# EAGLE design ekta_mcp1640_eval_002 (EAGLE 5.10)
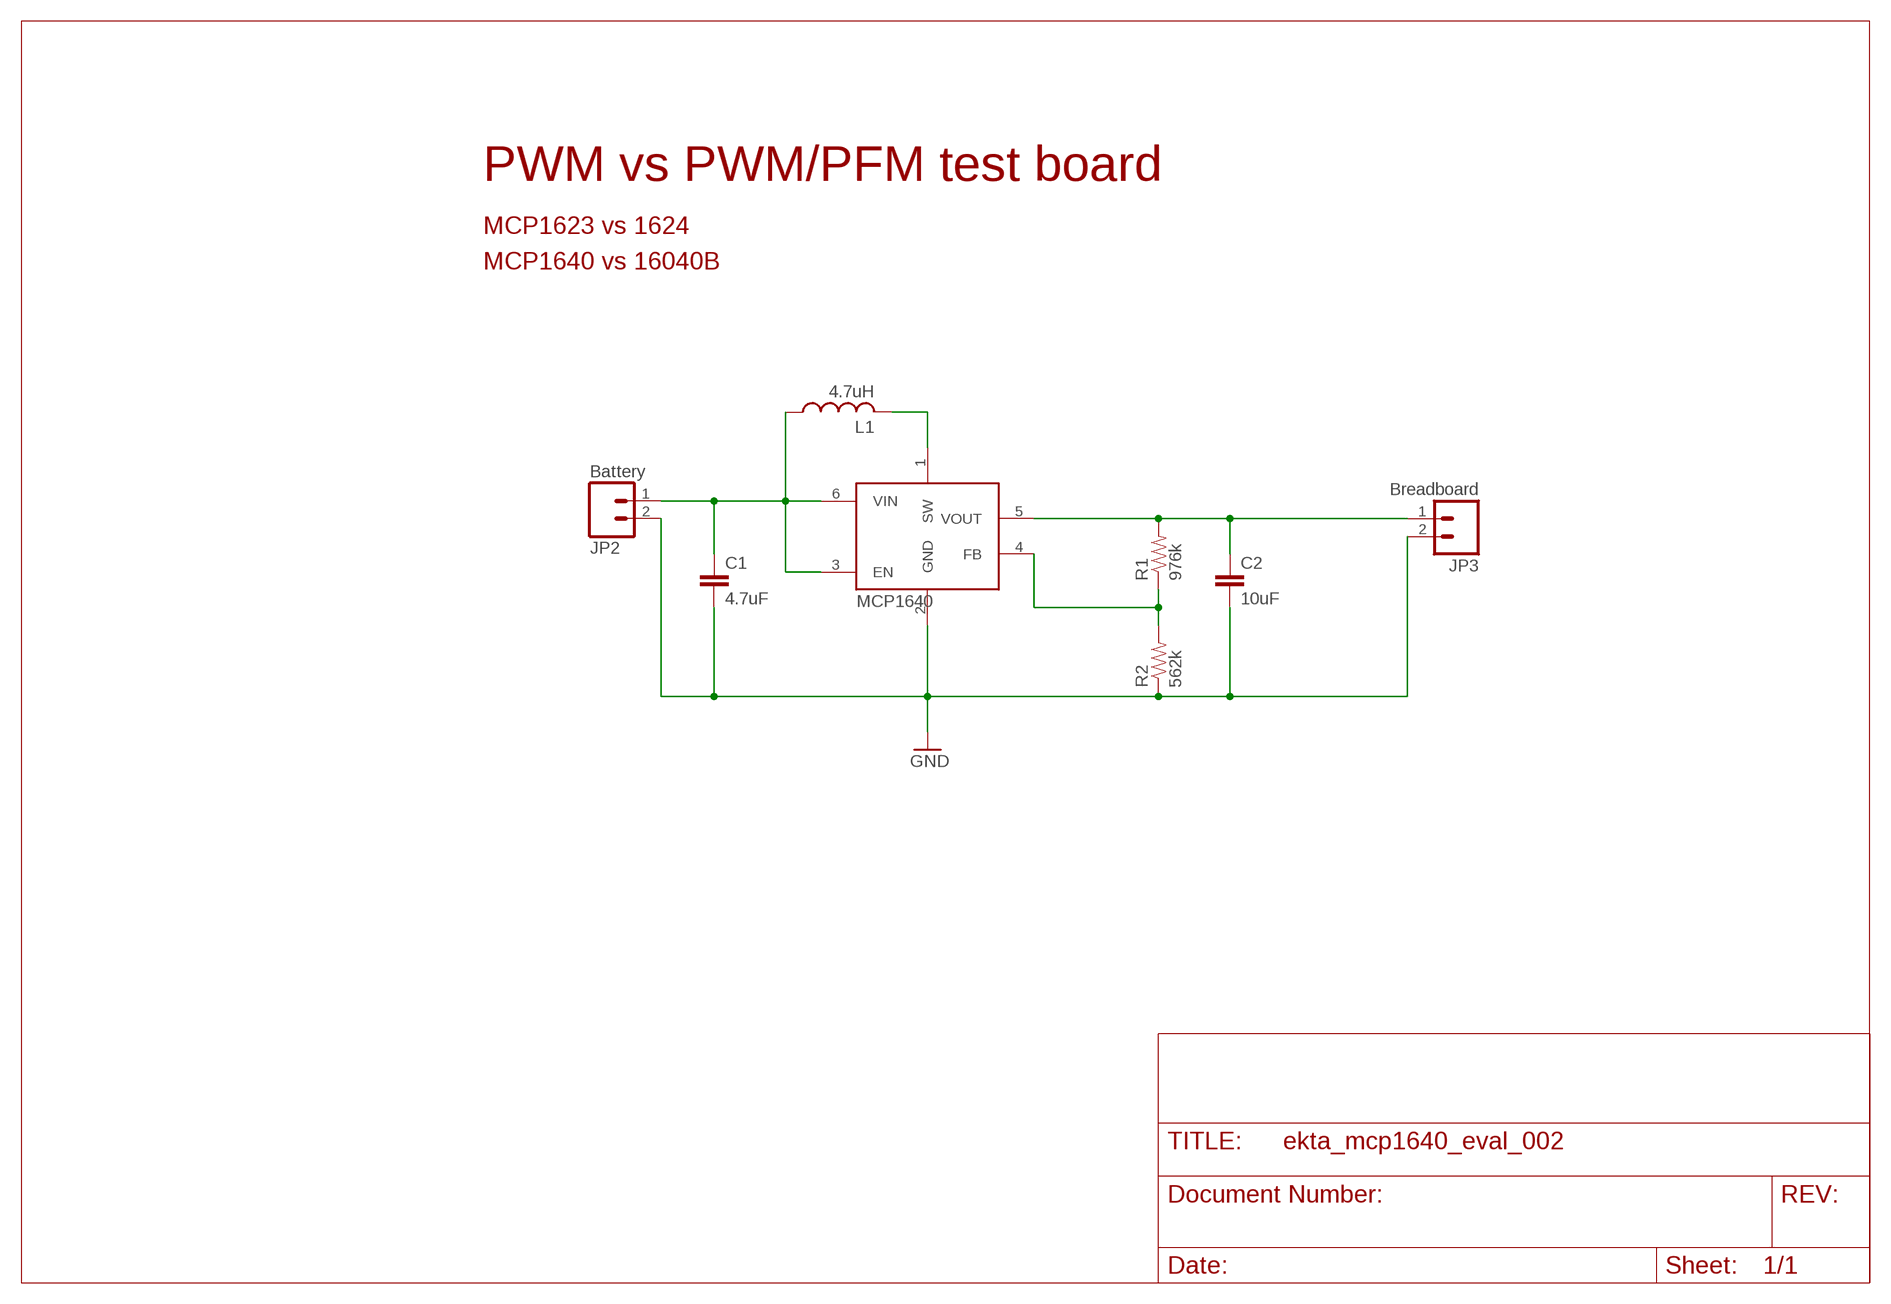
[diagram p0: schematic, sheet 1]

## Parts
C1  4.7uF  CAP0805  [0805]
C2  10uF  CAP0805  [0805]
JP2  Battery  M02PTH  [1X02]
JP3  Breadboard  M02PTH  [1X02]
L1  4.7uH  LLQH44P_P0  [LQH44]
R1  976k  RESISTOR0805-RES  [0805]
R2  562k  RESISTOR0805-RES  [0805]
U1  MCP1640  [SOT23-6]

## Nets
BAT+: C1.1 JP2.1 L1.P$1 U1.3(EN) U1.6(VIN)
GND: C1.2 C2.2 JP2.2 JP3.2 R2.1 U1.2(GND)
N$1: L1.P$2 U1.1(SW)
N$2: C2.1 JP3.1 R1.2 U1.5(VOUT)
N$4: R1.1 R2.2 U1.4(FB)

## Notes on the sheet
- PWM vs PWM/PFM test board
- MCP1623 vs 1624
- MCP1640 vs 16040B

## Library data of the parts
C1 C2 = SparkFun:CAP: Capacitor Standard 0603 ceramic capacitor, and 0.1" leaded capacitor.
JP2 JP3 = SparkFun:M02: Header 2 Standard 2-pin 0.1" header. Use with straight break away headers (SKU : PRT-00116), right angle break away headers (PRT-00553), swiss pins (PRT-00743), machine pins (PRT-00117), and female headers (PRT-00115). Molex polarized connector foot print use with SKU : PRT-08233 with associated crimp pins and housings.
L1 = karlnet-parts:L
R1 R2 = SparkFun:RESISTOR: Resistor Basic schematic elements and footprints for 0603, 1206, and PTH resistors.
U1 = karlnet-parts:MCP1640: MCP1623, 1624, 1640/B/C/D pwm/pfm or pwm only DC/DC converters, in SOT-23

## Board
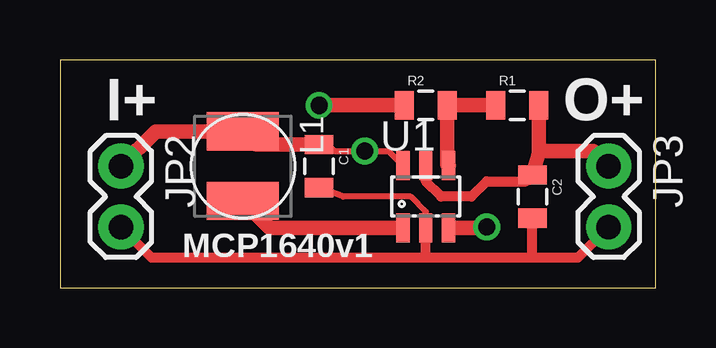
[diagram p1: board, top side]
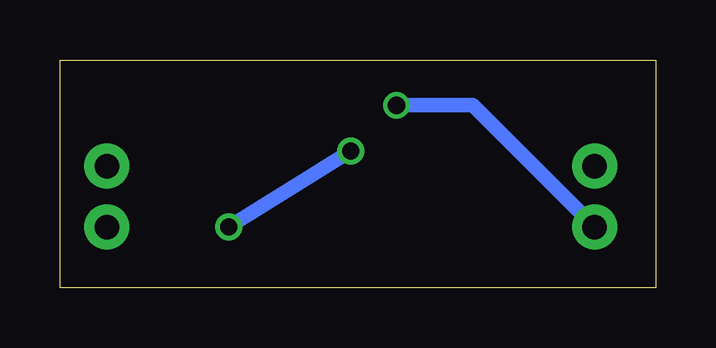
[diagram p2: board, bottom side, seen from below]

Size 24.82 x 9.52 mm. Coordinates in mm from the lower left corner, seen from the top.
Outline: 0,0 24.82,0 24.82,9.52 0,9.52 0,0
Copper layers (1*16): Top 0.035mm / dielectric 1.5mm / Bottom 0.035mm
Design rules "olimex-10mils": minimum track width 10mil, minimum drill 24mil, track to track 10mil, track to pad 10mil, pad to pad 10mil, via to via 10mil, smd to smd 10mil, copper to edge 40mil, drill to drill 10mil, minimum pad ring 10mil, minimum via ring 8mil, stop-mask expansion 0mil, vias tented up to drill 0mil, thermal gap 10mil

### Footprints (pad centres in the part's own frame; a part is rotated, then mirrored left to right if it is on the bottom)
0805 = smd 0.8 x 1.2: 1 -0.9,0; 2 0.9,0
1X02 = drill 1.016 pad 1.88 round: 1 0,0; 2 2.54,0
LQH44 = smd 1.6 x 3: P$1 -1.45,0; P$2 1.45,0
SOT23-6 = smd 0.55 x 1.2: 1 -0.95,-1.3; 2 0,-1.3; 3 0.95,-1.3; 4 0.95,1.3; 5 0,1.3; 6 -0.95,1.3

### Placement (x,y rotation side)
C1  10.79,5.08 270 top
C2  19.68,3.81 270 top
JP2  2.54,5.08 270 top
JP3  22.86,5.08 270 top
L1  7.62,5.08 270 top
R1  19.05,7.62 0 top
R2  15.24,7.62 0 top
U1  15.24,3.81 0 top

### Tracks (layer width: path | path; a pad name or v marks a point on that pad's centre or on a via)
BAT+  (via drill 0.71)
  Top 0.254: C1.1 11.16,5.98 11.43,5.71 v12.7,5.71 13.69,5.71 U1.6
  Top 0.61: JP2.1 3.99,6.53 L1.P$1 8.17,5.98 C1.1 | U1.3 17.75,2.51 v17.78,2.54
  Bottom 0.61: v12.7,5.71 v17.78,2.54
GND  (via drill 0.71)
  Top 0.254: U1.2 15.24,3.17 14.61,3.81 11.8,3.81 C1.2
  Top 0.406: JP2.2 3.81,1.27 15.24,1.27 | 15.24,1.27 19.68,1.27 | 19.68,1.27 21.59,1.27 JP3.2 | 19.68,1.27 C2.2 | 15.24,1.27 U1.2
  Top 0.61: v10.79,7.62 R2.1
  Bottom 0.61: v10.79,7.62 7.62,7.62 JP2.2
N$1
  Top 0.61: L1.P$2 8.74,2.51 U1.1
N$2
  Top 0.406: U1.5 15.24,4.45 15.88,3.81 17.14,3.81 17.78,4.45 19.42,4.45 C2.1
  Top 0.61: 19.95,5.71 19.95,5.61 C2.1 | 19.95,5.71 R1.2 | JP3.1 22.23,5.71 19.95,5.71
N$4
  Top 0.61: R1.1 R2.2 16.14,5.16 U1.4

### Text on the board
tPlace: I+ | O+ | MCP1640v1